# EAGLE schematic schematic (EAGLE 9.6.1)
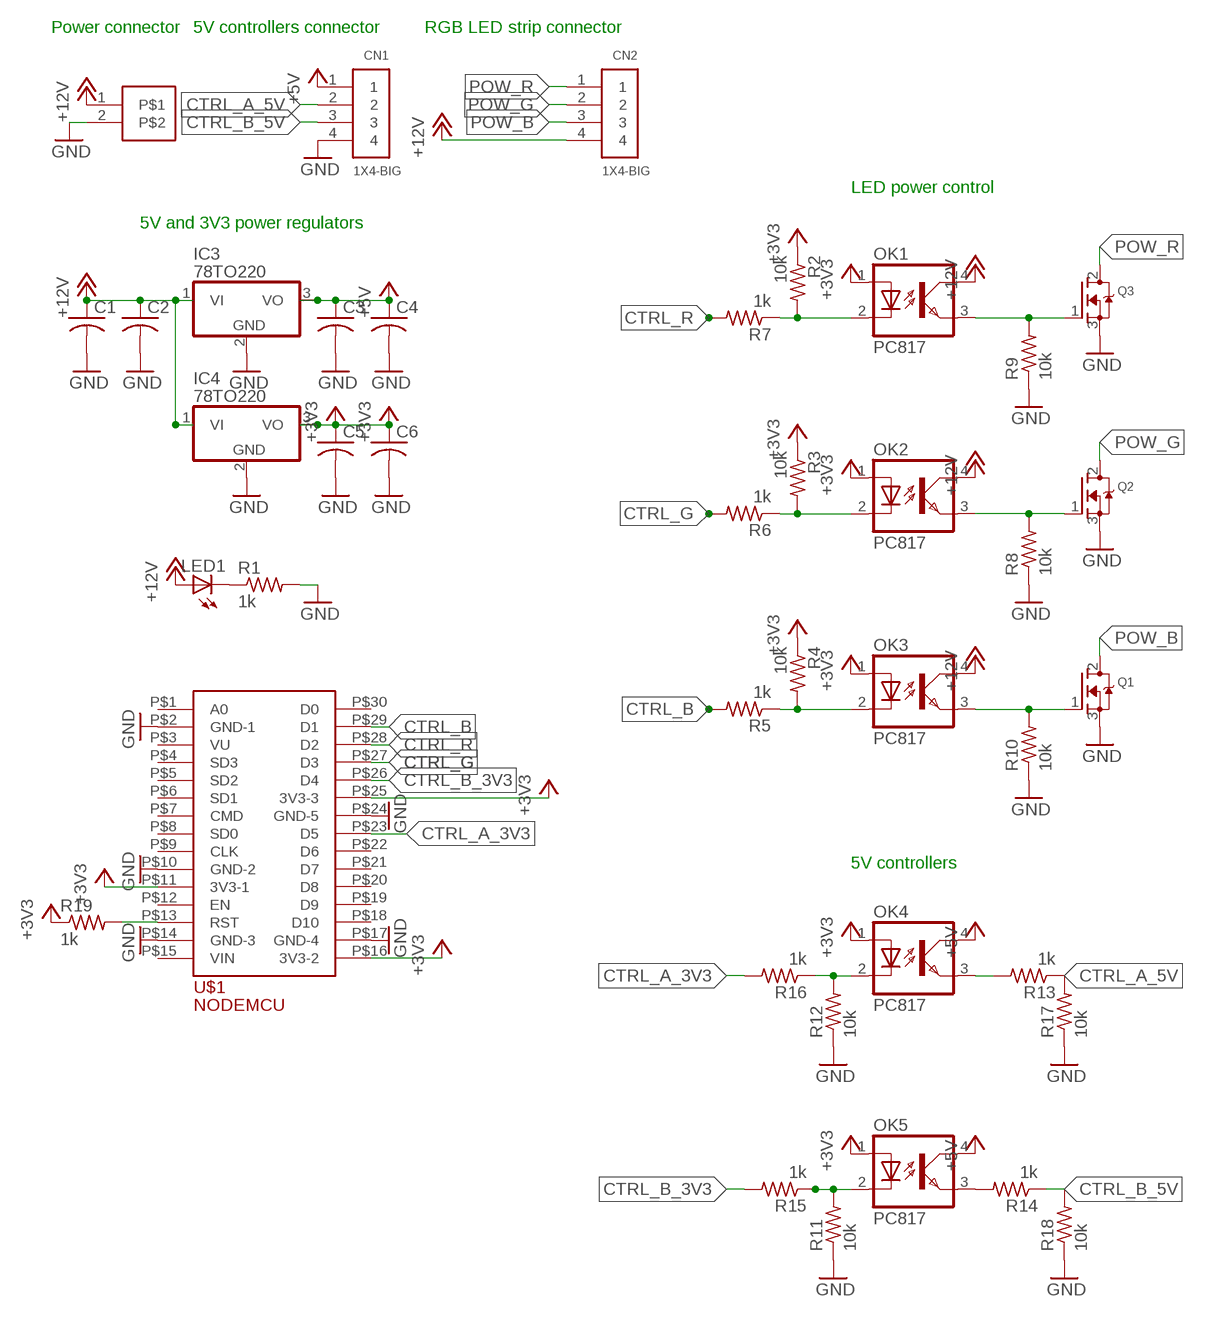
[diagram p0: schematic, sheet 1]

## Parts
C1  C-USC0805  [C0805]
C2  C-USC0805  [C0805]
C3  C-USC0805  [C0805]
C4  C-USC0805  [C0805]
C5  C-USC0805  [C0805]
C6  C-USC0805  [C0805]
CN1  1X4-BIG  [1X04-BIG]
CN2  1X4-BIG  [1X04-BIG]
IC3  78TO220  [TO220V]
IC4  78TO220  [TO220V]
LED1  LEDSMT1206  [1206]
OK1  PC817  [DIL04]
OK2  PC817  [DIL04]
OK3  PC817  [DIL04]
OK4  PC817  [DIL04]
OK5  PC817  [DIL04]
Q1  MOSFET-NGDS_TO220V  [TO220V]
Q2  MOSFET-NGDS_TO220V  [TO220V]
Q3  MOSFET-NGDS_TO220V  [TO220V]
R1  1k  R-US_M0805  [M0805]
R2  10k  R-US_R0805  [R0805]
R3  10k  R-US_R0805  [R0805]
R4  10k  R-US_R0805  [R0805]
R5  1k  R-US_R0805  [R0805]
R6  1k  R-US_R0805  [R0805]
R7  1k  R-US_R0805  [R0805]
R8  10k  R-US_R0805  [R0805]
R9  10k  R-US_R0805  [R0805]
R10  10k  R-US_R0805  [R0805]
R11  10k  R-US_R0805  [R0805]
R12  10k  R-US_R0805  [R0805]
R13  1k  R-US_R0805  [R0805]
R14  1k  R-US_R0805  [R0805]
R15  1k  R-US_R0805  [R0805]
R16  1k  R-US_R0805  [R0805]
R17  10k  R-US_R0805  [R0805]
R18  10k  R-US_R0805  [R0805]
R19  1k  R-US_M0805  [M0805]
U$1  ESP8266  [ESP8266-NODEMCU]
U$2  HEADER-2X1  [HEADER-2X1]

## Nets
+3V3: C5.1 C6.1 IC4.3(VO) OK1.1(A) OK2.1(A) OK3.1(A) OK4.1(A) OK5.1(A) R2.1 R3.1 R4.1 R19.1 U$1.P$11(3V3-1) U$1.P$16(3V3-2) U$1.P$25(3V3-3)
+5V: C3.1 C4.1 CN1.1 IC3.3(VO) OK4.4(COL) OK5.4(COL)
+12V: C1.1 C2.1 CN2.4 IC3.1(VI) IC4.1(VI) LED1.A OK1.4(COL) OK2.4(COL) OK3.4(COL) U$2.1
CTRL_A_3V3: R16.2 U$1.P$23(D5)
CTRL_A_5V: CN1.2 R13.1 R17.2
CTRL_B: R5.2 U$1.P$29(D1)
CTRL_B_3V3: R15.2 U$1.P$26(D4)
CTRL_B_5V: CN1.3 R14.1 R18.2
CTRL_G: R6.2 U$1.P$27(D3)
CTRL_R: R7.2 U$1.P$28(D2)
GND: C1.2 C2.2 C3.2 C4.2 C5.2 C6.2 CN1.4 IC3.2(GND) IC4.2(GND) Q1.3(S) Q2.3(S) Q3.3(S) R1.2 R8.1 R9.1 R10.1 R11.1 R12.1 R17.1 R18.1 U$1.P$2(GND-1) U$1.P$10(GND-2) U$1.P$14(GND-3) U$1.P$17(GND-4) U$1.P$24(GND-5) U$2.2
N$1: OK1.2(C) R2.2 R7.1
N$2: LED1.C R1.1
N$3: OK2.2(C) R3.2 R6.1
N$4: OK3.2(C) R4.2 R5.1
N$5: OK3.3(EMIT) Q1.1(G) R10.2
N$6: OK2.3(EMIT) Q2.1(G) R8.2
N$7: OK1.3(EMIT) Q3.1(G) R9.2
N$8: R19.2 U$1.P$13(RST)
N$9: OK5.3(EMIT) R14.2
N$10: OK5.2(C) R11.2 R15.1
N$11: OK4.2(C) R12.2 R16.1
N$12: OK4.3(EMIT) R13.2
POW_B: CN2.3 Q1.2(D)
POW_G: CN2.2 Q2.2(D)
POW_R: CN2.1 Q3.2(D)
Unconnected: U$1.P$1(A0) U$1.P$3(VU) U$1.P$4(SD3) U$1.P$5(SD2) U$1.P$6(SD1) U$1.P$7(CMD) U$1.P$8(SD0) U$1.P$9(CLK) U$1.P$12(EN) U$1.P$15(VIN) U$1.P$18(D10) U$1.P$19(D9) U$1.P$20(D8) U$1.P$21(D7) U$1.P$22(D6) U$1.P$30(D0)

## Notes on the sheet
- Power connector | 5V controllers connector | RGB LED strip connector
- LED power control
- 5V and 3V3 power regulators
- 5V controllers

## Library data of the parts
C1-C6 = adafruit:C-US: CAPACITOR, American symbol
CN1 CN2 = adafruit:1X4: 4-pin connector
IC3 IC4 = adafruit:78*: Positive VOLTAGE REGULATOR Added bigger pads to the TO-92 package
LED1 = adafruit:LED: LED OSRAM: - CHIPLED LG R971, LG N971, LY N971, LG Q971, LY Q971, LO R971, LY R971 LH N974, LH R974 LS Q976, LO Q976, LY Q976 LO Q996 - Hyper CHIPLED LW Q18S LB Q993, LB Q99A, LB R99A - SideLED LS A670, LO A670, LY A670, LG A670, LP A670 LB A673, LV A673, LT A673, LW A673 LH A674 LY A675 LS A676, LA A676, LO A676, LY A676, LW A676 LS A679, LY A679, LG A679 - Hyper Micro SIDELED® LS Y876, LA Y876, LO Y876, LY Y876 LT Y87S - SmartLED LW L88C, LW L88S LB L89C, LB L89S, LG L890 LS L89K, LO L89K, LY L89K LS L896, LA L896, LO L896, LY L896 - TOPLED LS T670, LO T670, LY T670, LG T670, LP T670 LSG T670, LSP T670, LSY T670, LOP T670, LYG T670 LG T671, LOG T671, LSG T671 LB T673, LV T673, LT T673, LW T673 LH T674 LS T676, LA T676, LO T676, LY T676, LB T676, LH T676, LSB T676, LW T676 LB T67C, LV T67C, LT T67C, LS T67K, LO T67K, LY T67K, LW E67C LS E67B, LA E67B, LO E67B, LY E67B, LB E67C, LV E67C, LT E67C LW T67C LS T679, LY T679, LG T679 LS T770, LO T770, LY T770, LG T770, LP T770 LB T773, LV T773, LT T773, LW T773 LH T774 LS E675, LA E675, LY E675, LS T675 LS T776, LA T776, LO T776, LY T776, LB T776 LHGB T686 LT T68C, LB T68C - Hyper Mini TOPLED® LB M676 - Mini TOPLED Santana® LG M470 LS M47K, LO M47K, LY M47K Source: http://www.osram.convergy.de/
OK1-OK5 = optocoupler:PC817: SHARP OPTO COUPLER; MPN: PC817X4J000F; OC_FARNELL: 9707727; OC_NEWARK: 97K7059
Q1-Q3 = adafruit:MOSFET-N: N-Channel Mosfet 2N7002E - 60V 260mA SOT23 [Digikey: 2N7002ET1GOSTR-ND] - REEL BSH103 - 30V 850mA SOT23 [Digikey: 568-5013-1-ND]
R1-R19 = adafruit:R-US_: RESISTOR, American symbol
U$1 = z-lib:ESP8266
U$2 = z-lib:HEADER-2X1